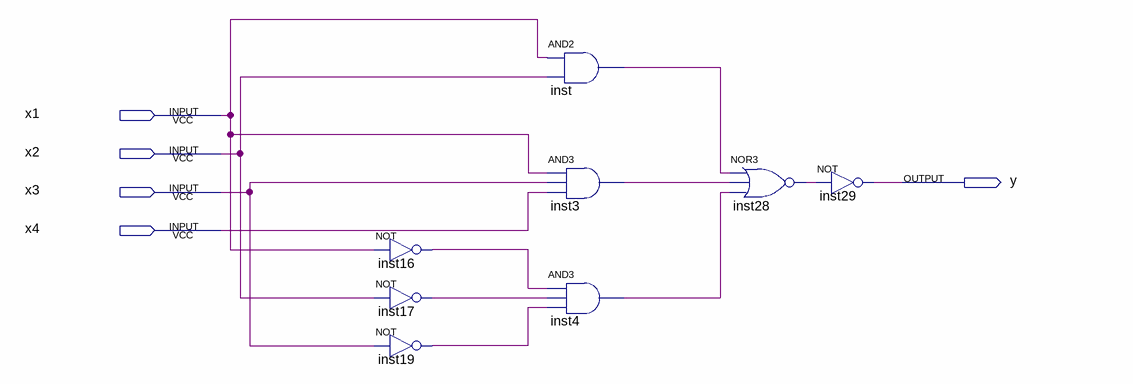
[diagram p0: schematic sheet]
// Quartus schematic LC_1.bdf as structural Verilog: 8 symbols, 5 pins
module LC_1 (
  input  x1,
  input  x2,
  input  x3,
  input  x4,
  output y
);

  wire inst3_out, inst4_out, inst16_out, inst17_out, inst19_out, inst28_out, inst_out;

  not inst16 (inst16_out, x1);
  not inst17 (inst17_out, x2);
  not inst19 (inst19_out, x3);
  and inst (inst_out, x1, x2);
  and inst3 (inst3_out, x1, x3, x4);
  and inst4 (inst4_out, inst16_out, inst17_out, inst19_out);
  nor inst28 (inst28_out, inst_out, inst3_out, inst4_out);
  not inst29 (y, inst28_out);
endmodule
